# EasyEDA Pro project 交通信号灯第四版.epro

# Schematic Schematic1
Create Date: 2024-06-14; Page Name: P1; Project Name: 转接板第四版; Schematic Name: Schematic1; Update Date: 2024-06-14; Company: 嘉立创EDA; Page Size: A4; Version: V1.0
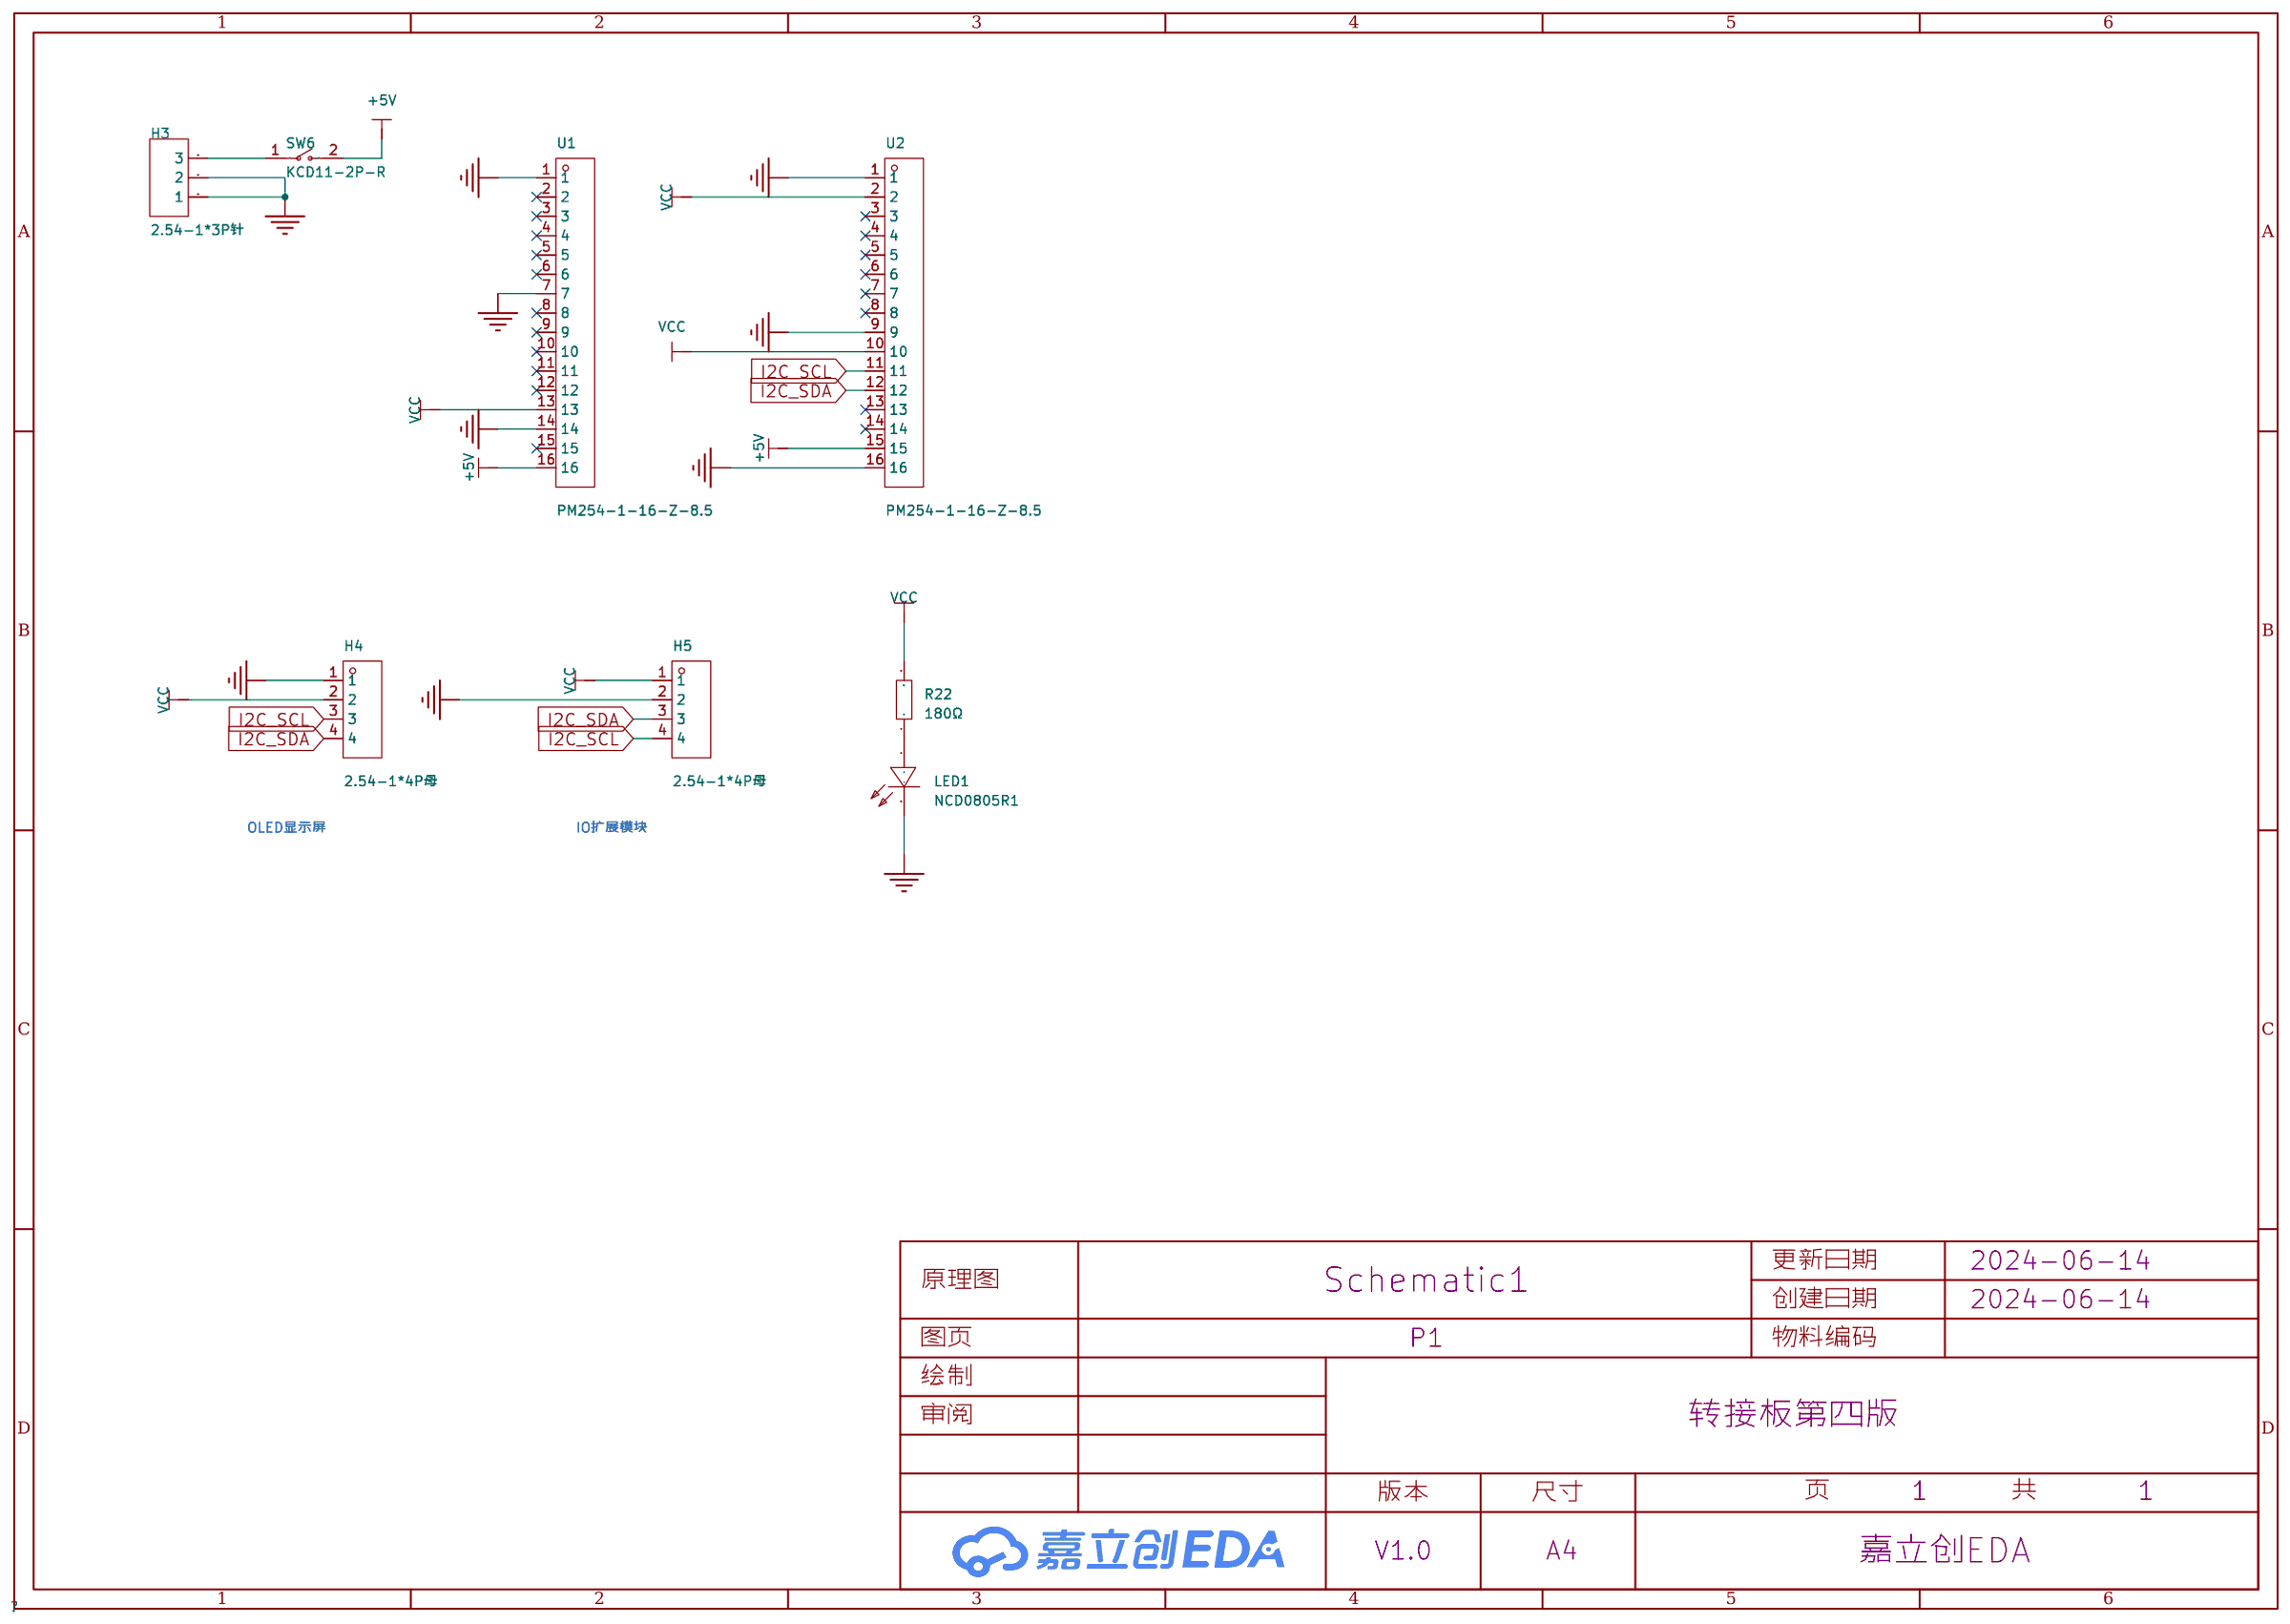
[diagram p0: schematic sheet]

## Parts
H3  2.54-1*3P针  [HDR-TH_3P-P2.54-V-M-1]
H4  2.54-1*4P母  [HDR-TH_4P-P2.54-V-F]
H5  2.54-1*4P母  [HDR-TH_4P-P2.54-V-F]
LED1  NCD0805R1  [LED0805-R-RD]
R22  180Ω  [R0805]
SW6  KCD11-2P-R  [SW-TH_2P-L15.0-W10.5-P5.00_KCD11-2P-R]
U1  PM254-1-16-Z-8.5  [HDR-TH_16P-P2.54-V-F-A]
U2  PM254-1-16-Z-8.5  [HDR-TH_16P-P2.54-V-F-A]

## Library data of the parts
H3 = 2.54-1*3P针: 插针结构:1x3P;间距:2.54mm;行距:-;圆针/方针:方针;安装类型:直插;排数:单排;总PIN位数:3P;额定电流:3A;额定电压:-;配合针长度:-;塑高:-;端接针长度:-;触头材质:-;触头镀层:-;工作温度范围:-40℃~+105℃;颜色:黑色;; LCSC Part Name: 间距:2.54mm 1x3P 直插 方针; Supplier Part: C49257; Manufacturer: BOOMELE(博穆精密); Supplier Footprint: 插件,P=2.54mm; JLCPCB Part Class: 扩展库; Datasheet: https://atta.szlcsc.com/upload/public/pdf/source/20221018/3E9408392E35E6F57A28985E5F7BF5C9.pdf; Supplier: LCSC; Pin Structure: 1x3P; Pitch: 2.54mm; Circluar Pins/Square Pins: 方针; Mounting Type: 直插; Number of Rows: 单排; Number of Pins: 3P; Current Rating (Max): 3A; Operating Temperature Range: -40℃~+105℃; Color: 黑色
H4 H5 = 2.54-1*4P母: 插孔结构:1x4P;间距:2.54mm;行距:-;圆孔/方孔:方孔;安装类型:直插;排数:单排;总孔位数:4P;额定电流:3A;额定电压:-;插孔方向:顶部;塑高:-;触头材质:青铜;触头镀层:-;工作温度范围:-40℃~+105℃;焊接温度(最大值):-;; LCSC Part Name: 间距:2.54mm 1x4P 直插; Supplier Part: C2718488; Manufacturer: BOOMELE(博穆精密); Supplier Footprint: 插件,P=2.54mm; JLCPCB Part Class: 扩展库; Datasheet: https://atta.szlcsc.com/upload/public/pdf/source/20210301/C2718488_F4427B881E42CAA8DDB0B1C12B3A522C.pdf; Supplier: LCSC; Holes Structure: 1x4P; Pitch: 2.54mm; Circular Hole / Square Hole: 方孔; Mounting Type: 直插; Number of Rows: 单排; Number of Holes: 4P; Current Rating (Max): 3A; Holes Direction: 顶部; Contact Material: 青铜; Operating Temperature Range: -40℃~+105℃
LED1 = NCD0805R1: 灯头类型:-;发光颜色:红色;正向电压(VF):1.6V~2.6V;功率:65mW;正向电流:20mA;主波长:615nm~630nm;二极管配置:独立二极管;透镜颜色:无色透明透镜;色温:-;发光强度:67mcd~195mcd;发光角度:130°;载带方式:-;工作温度:-30℃~+85℃;; Supplier Part: C84256; Manufacturer: 国星光电; Supplier Footprint: 0805; JLCPCB Part Class: 基础库; Datasheet: https://atta.szlcsc.com/upload/public/pdf/source/20200820/C84256_F0A75A43B3EAD75808600A0514C76B99.pdf; Supplier: LCSC; Emitted Color: 红色; Forward Voltage (VF): 1.6V~2.6V; Power Dissipation: 65mW; Forward Current: 20mA; Dominant Wavelength: 615nm~630nm; Diode Configuration: 独立二极管; Lens Color: 无色透明透镜; Luminous Intensity: 67mcd~195mcd; Viewing Angle: 130°; Operating Temperature: -30℃~+85℃
R22 = 0805W8F1800T5E: 电阻类型:厚膜电阻;阻值:180Ω;精度:±1%;功率:125mW;最大工作电压:150V;温度系数:±100ppm/℃;; LCSC Part Name: 180Ω ±1% 125mW 厚膜电阻; Supplier Part: C25270; Manufacturer: UNI-ROYAL(厚声); Supplier Footprint: 0805; JLCPCB Part Class: 扩展库; Datasheet: https://atta.szlcsc.com/upload/public/pdf/source/20200306/C422600_1E6D84923E4A46A82E41ADD87F860B5C.pdf; Supplier: LCSC; Type: 厚膜电阻; Tolerance: ±1%; Power(Watts): 125mW; Overload Voltage (Max): 150V; Temperature Coefficient: ±100ppm/℃; Operating Temperature Range: -55℃~+155℃
SW6 = KCD11-2P-R: 带灯:无;引脚样式:焊片;额定电流:3A;额定电压(AC):250V;额定电压(DC):-;电路结构:单刀单掷;机械寿命:1万次;; LCSC Part Name: 10.5*15mm 两脚两档跷板开关 红钮; Supplier Part: C5884414; Manufacturer: SHOU HAN(首韩); Supplier Footprint: 插件; JLCPCB Part Class: 扩展库; Datasheet: https://atta.szlcsc.com/upload/public/pdf/source/20230506/CD06DFDE35C8048D34175BFF4AF6A2C2.pdf; Supplier: LCSC; Switch Length: 15mm; Switch Width: 10.5mm; Switch Height: 17.2mm; Actuator Type: 凹面弯曲; With Lamp: 无; Pin Style: 焊片; Actuator Color: 红色; Contact Current: 3A; Voltage Rating (AC): 250V; Circuit: 单刀单掷; Mechanical Life: 1万次; Operating Temperature: 0℃~+125℃; Actuator Identifier: - O
U1 U2 = PM254-1-16-Z-8.5: 插孔结构:1x16P;间距:2.54mm;行距:-;圆孔/方孔:方孔;安装类型:直插;排数:单排;总孔位数:16P;额定电流:3A;额定电压:-;插孔方向:顶部;塑高:8.5mm;触头材质:铜合金;工作温度范围:-40℃~+105℃;焊接温度(最大值):260℃@5S;; LCSC Part Name: 1x16P 间距:2.54mm 直插; Supplier Part: C2897379; Manufacturer: HCTL(华灿天禄); Supplier Footprint: 插件,P=2.54mm; JLCPCB Part Class: 扩展库; Datasheet: https://atta.szlcsc.com/upload/public/pdf/source/20230609/534BE42964C679BDE98E061007C4ABD6.pdf; Supplier: LCSC; Holes Structure: 1x16P; Pitch: 2.54mm; Circular Hole / Square Hole: 方孔; Mounting Type: 直插; Number of Rows: 单排; Number of Holes: 16P; Current Rating (Max): 3A; Holes Direction: 顶部; Insulation Height: 8.5mm; Contact Material: 铜合金; Operating Temperature Range: -40℃~+105℃; Soldering Temperature(Max): 260℃@5S

## Nets
+5V: SW6.2 U1.16 U2.15
GND: H3.1 H3.2 H4.1 H5.2 LED1.2(-) U1.1 U1.7 U1.14 U2.1 U2.9 U2.16
VCC: H4.2 H5.1 R22.2 U1.13 U2.2 U2.10
I2C_SCL: H4.3 H5.4 U2.11
I2C_SDA: H4.4 H5.3 U2.12
$1N1443: LED1.1(+) R22.1
$1N1633: H3.3 SW6.1

Not connected (* = marked no-connect by the designer): U1 2* 3* 4* 5* 6* 8* 9* 10* 11* 12* 15*; U2 3* 4* 5* 6* 7* 8* 13* 14*

## Notes on the sheet
- OLED显示屏
- IO扩展模块

# Board PCB1
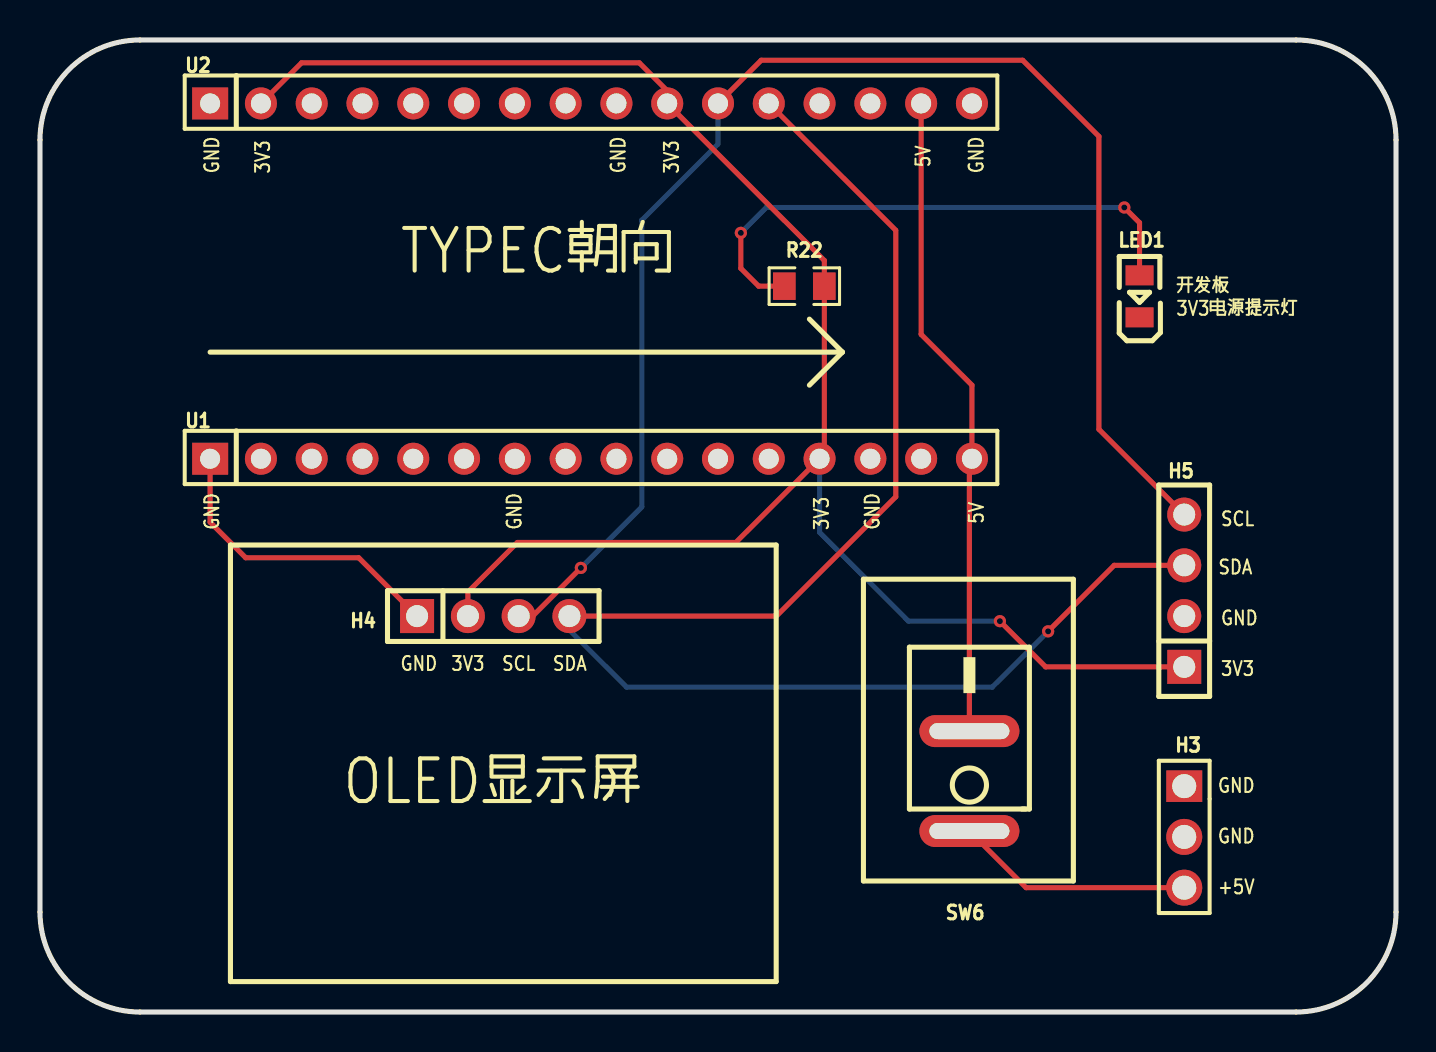
[diagram p1: board, top side]
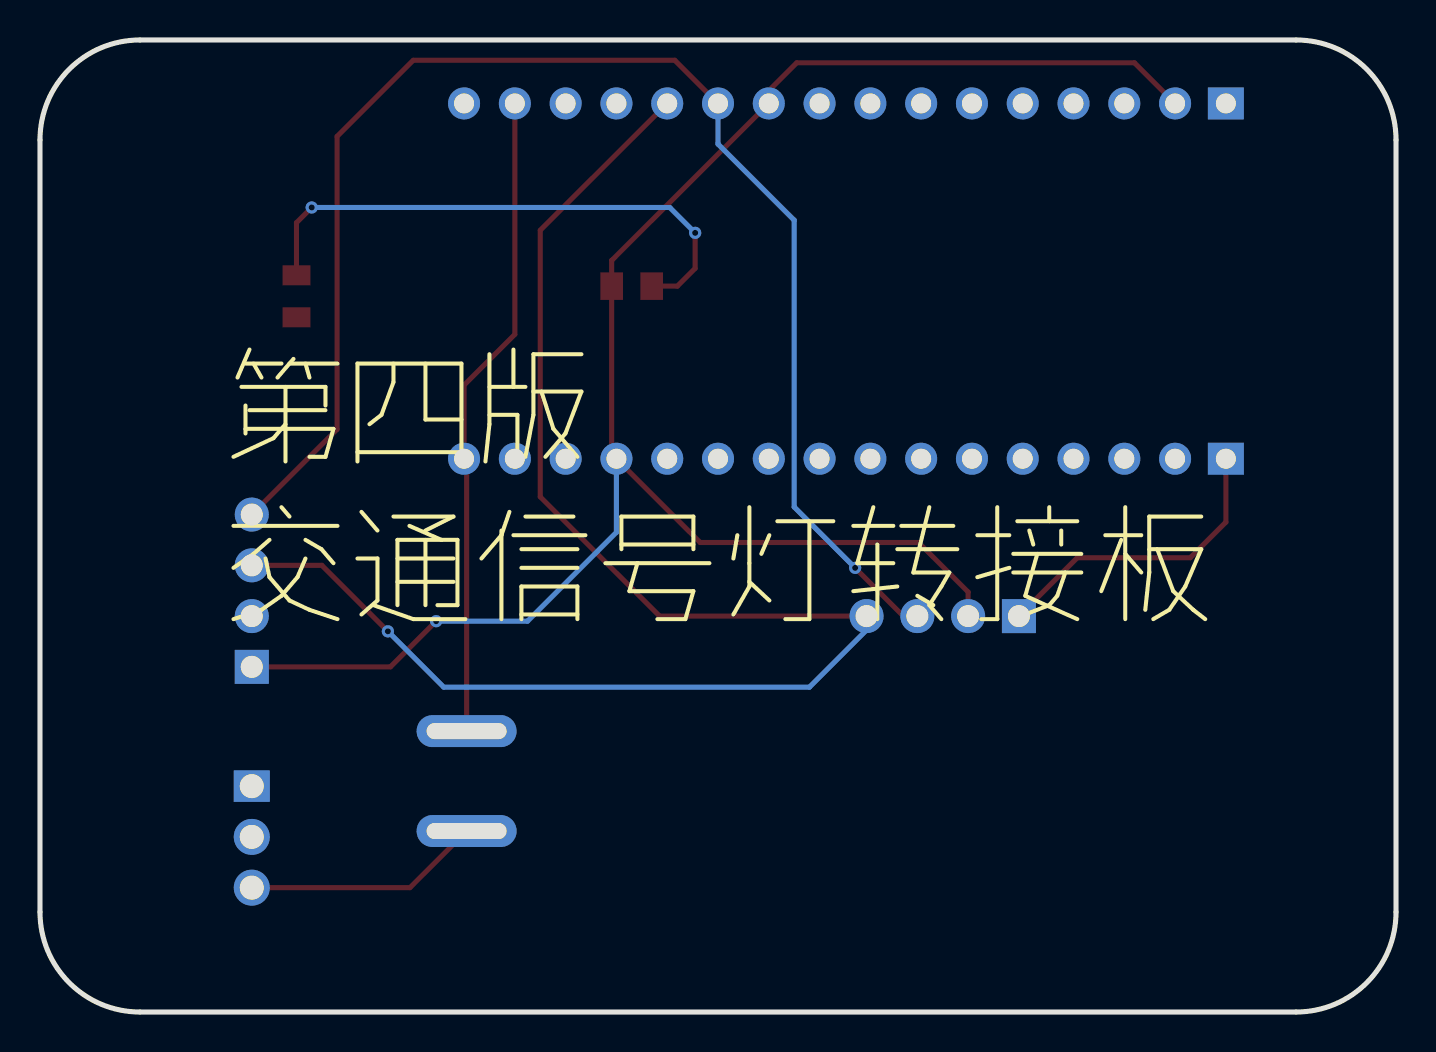
[diagram p2: board, bottom side, seen from below]

Outline 67.82 x 48.64 mm; copper layers: Top Layer, Bottom Layer. Coordinates in mm from the lower left corner of the outline.
Outline path: 0,43.64 0,5 arc(1.46,1.46) 5,0 62.82,0 arc(66.35,1.46) 67.82,5 67.82,43.64 arc(66.35,47.18) 62.82,48.64 5,48.64 arc(1.46,47.18) 0,43.64
Stack: Top Layer 0.035mm / Dielectric1 1.51mm FR4 er 4.5 / Bottom Layer 0.035mm

## Design rules (mm)
template: JLCPCB Capability(Two Layers Board)
spacing copperThickness1oz (default): track to track 0.102, other pairs 0.152 to 0.3
spacing copperThickness2oz: track to track 0.203, other pairs 0.152 to 0.3
track width copperThickness1oz (default): min 0.127, default 0.254, max 2.54
track width copperThickness2oz: min 0.203, default 0.254, max 2.54
differential pair differentialPair (default): width min 0.127, default 0.254, max 2.54; gap min 0.152, default 0.152
via viaSize (default): diameter min 0.5, default 0.61, max 10; hole min 0.3, default 0.305, max 6.3

## Placement (name value [footprint] x y rotation side)
H3  2.54-1*3P针  [HDR-TH_3P-P2.54-V-M-1]  57.23 8.76 270 top
H4  2.54-1*4P母  [HDR-TH_4P-P2.54-V-F]  22.67 19.81 0 top
H5  2.54-1*4P母  [HDR-TH_4P-P2.54-V-F]  57.23 21.08 90 top
LED1  NCD0805R1  [LED0805-R-RD]  54.99 35.81 90 top
R22  180Ω  [R0805]  38.23 36.32 0 top
SW6  KCD11-2P-R  [SW-TH_2P-L15.0-W10.5-P5.00_KCD11-2P-R]  46.48 11.56 90 top
U1  PM254-1-16-Z-8.5  [HDR-TH_16P-P2.54-V-F-A]  27.56 27.69 0 top
U2  PM254-1-16-Z-8.5  [HDR-TH_16P-P2.54-V-F-A]  27.56 45.47 0 top

## Footprints (pads in the part's own frame, mm; a bottom-side part is the same pattern mirrored in y, then rotated)
HDR-TH_3P-P2.54-V-M-1
  rect 1.575x1.8 hole 1.2: 1(-2.54,0)
  round 1.8 hole 1.2: 2(0,0) 3(2.54,0)
HDR-TH_4P-P2.54-V-F
  rect 1.7x1.7 hole 1.1: 1(-3.81,0)
  round 1.7 hole 1.1: 2(-1.27,0) 3(1.27,0) 4(3.81,0)
HDR-TH_16P-P2.54-V-F-A
  rect 1.8x1.6 hole 1: 1(-19.05,0)
  round 1.6 hole 1: 2(-16.51,0) 3(-13.97,0) 4(-11.43,0) 5(-8.89,0) 6(-6.35,0) 7(-3.81,0) 8(-1.27,0) 9(1.27,0) 10(3.81,0) 11(6.35,0) 12(8.89,0) 13(11.43,0) 14(13.97,0) 15(16.51,0) 16(19.05,0)
LED0805-R-RD
  rect 1x1.399 smd: 1(1.05,0) 2(-1.05,0)
R0805
  rect 1.133x1.377 smd: 1(-1,0) 2(1,0)
SW-TH_2P-L15.0-W10.5-P5.00_KCD11-2P-R
  oval 1.6x5 hole 0.8x4: 1(-2.5,0) 2(2.5,0)

## Nets
As in the schematic.

Pads without a net: U1 2 3 4 5 6 8 9 10 11 12 15; U2 3 4 5 6 7 8 13 14

## Via types
v1: diameter 0.61, hole 0.305, Top Layer to Bottom Layer, 5 vias

## Routing (per net, layer and track width the routed paths; a pad name or vN(x,y) marks a point on that pad's centre or on a via; arc(x,y) is an arc through that point)
+5V: length 32.5
  Top Layer w0.254: U2.15 44.07,33.91 46.61,31.37 U1.16 46.48,27.56 SW6.2
GND: length 15.5
  Top Layer w0.254: U1.1 8.51,24.51 10.29,22.73 15.94,22.73 H4.1
VCC: length 89.8
  Top Layer w0.254: U2.2 13.08,47.5 29.97,47.5 31.37,46.1 U2.10 39.23,37.61 R22.2 39.23,27.92 U1.13 34.8,23.5 23.88,23.5 21.4,21.02 H4.2 ; v1(48.01,19.56) 50.29,17.27 H5.1
  Bottom Layer w0.254: U1.13 38.99,24 43.43,19.56 v1(48.01,19.56)
I2C_SCL: length 72.4
  Top Layer w0.254: H5.4 52.96,29.16 52.96,43.81 49.15,47.62 36.07,47.62 U2.11 ; H4.3 24.64,19.81 v1(27.05,22.23)
  Bottom Layer w0.254: U2.11 33.91,43.43 30.1,39.62 30.1,25.27 v1(27.05,22.23)
I2C_SDA: length 76.3
  Top Layer w0.254: H5.3 53.72,22.35 v1(50.42,19.05) ; U2.12 42.8,39.12 42.8,25.78 36.83,19.81 H4.4
  Bottom Layer w0.254: v1(50.42,19.05) 47.62,16.26 29.34,16.26 26.48,19.11 H4.4
$1N1443: length 27.7
  Top Layer w0.254: R22.1 35.94,36.32 35.05,37.21 v1(35.05,38.99) ; v1(54.23,40.26) 54.99,39.5 LED1.1
  Bottom Layer w0.254: v1(54.23,40.26) 36.32,40.26 v1(35.05,38.99)
$1N1633: length 11.9
  Top Layer w0.254: SW6.1 49.32,6.22 H3.3

## Copper pours and planes (outline as drawn; the poured copper is in the pictures)
GND on Top Layer: -3.3,53.09 78.1,53.09 78.1,-7.37 -3.3,-7.37
GND on Bottom Layer: -2.92,53.47 70.99,53.47 70.99,-1.9 -2.92,-1.9

## Text on the board
Bottom Silkscreen Layer: 第四版 / 交通信号灯转接板
Top Silkscreen Layer: GND | 3V3 | SCL | SDA | +5V | 5V | 开发板 / 3V3电源提示灯 | OLED显示屏 | TYPEC朝向
